# Altium schematic sheet Power.SchDoc
size A3
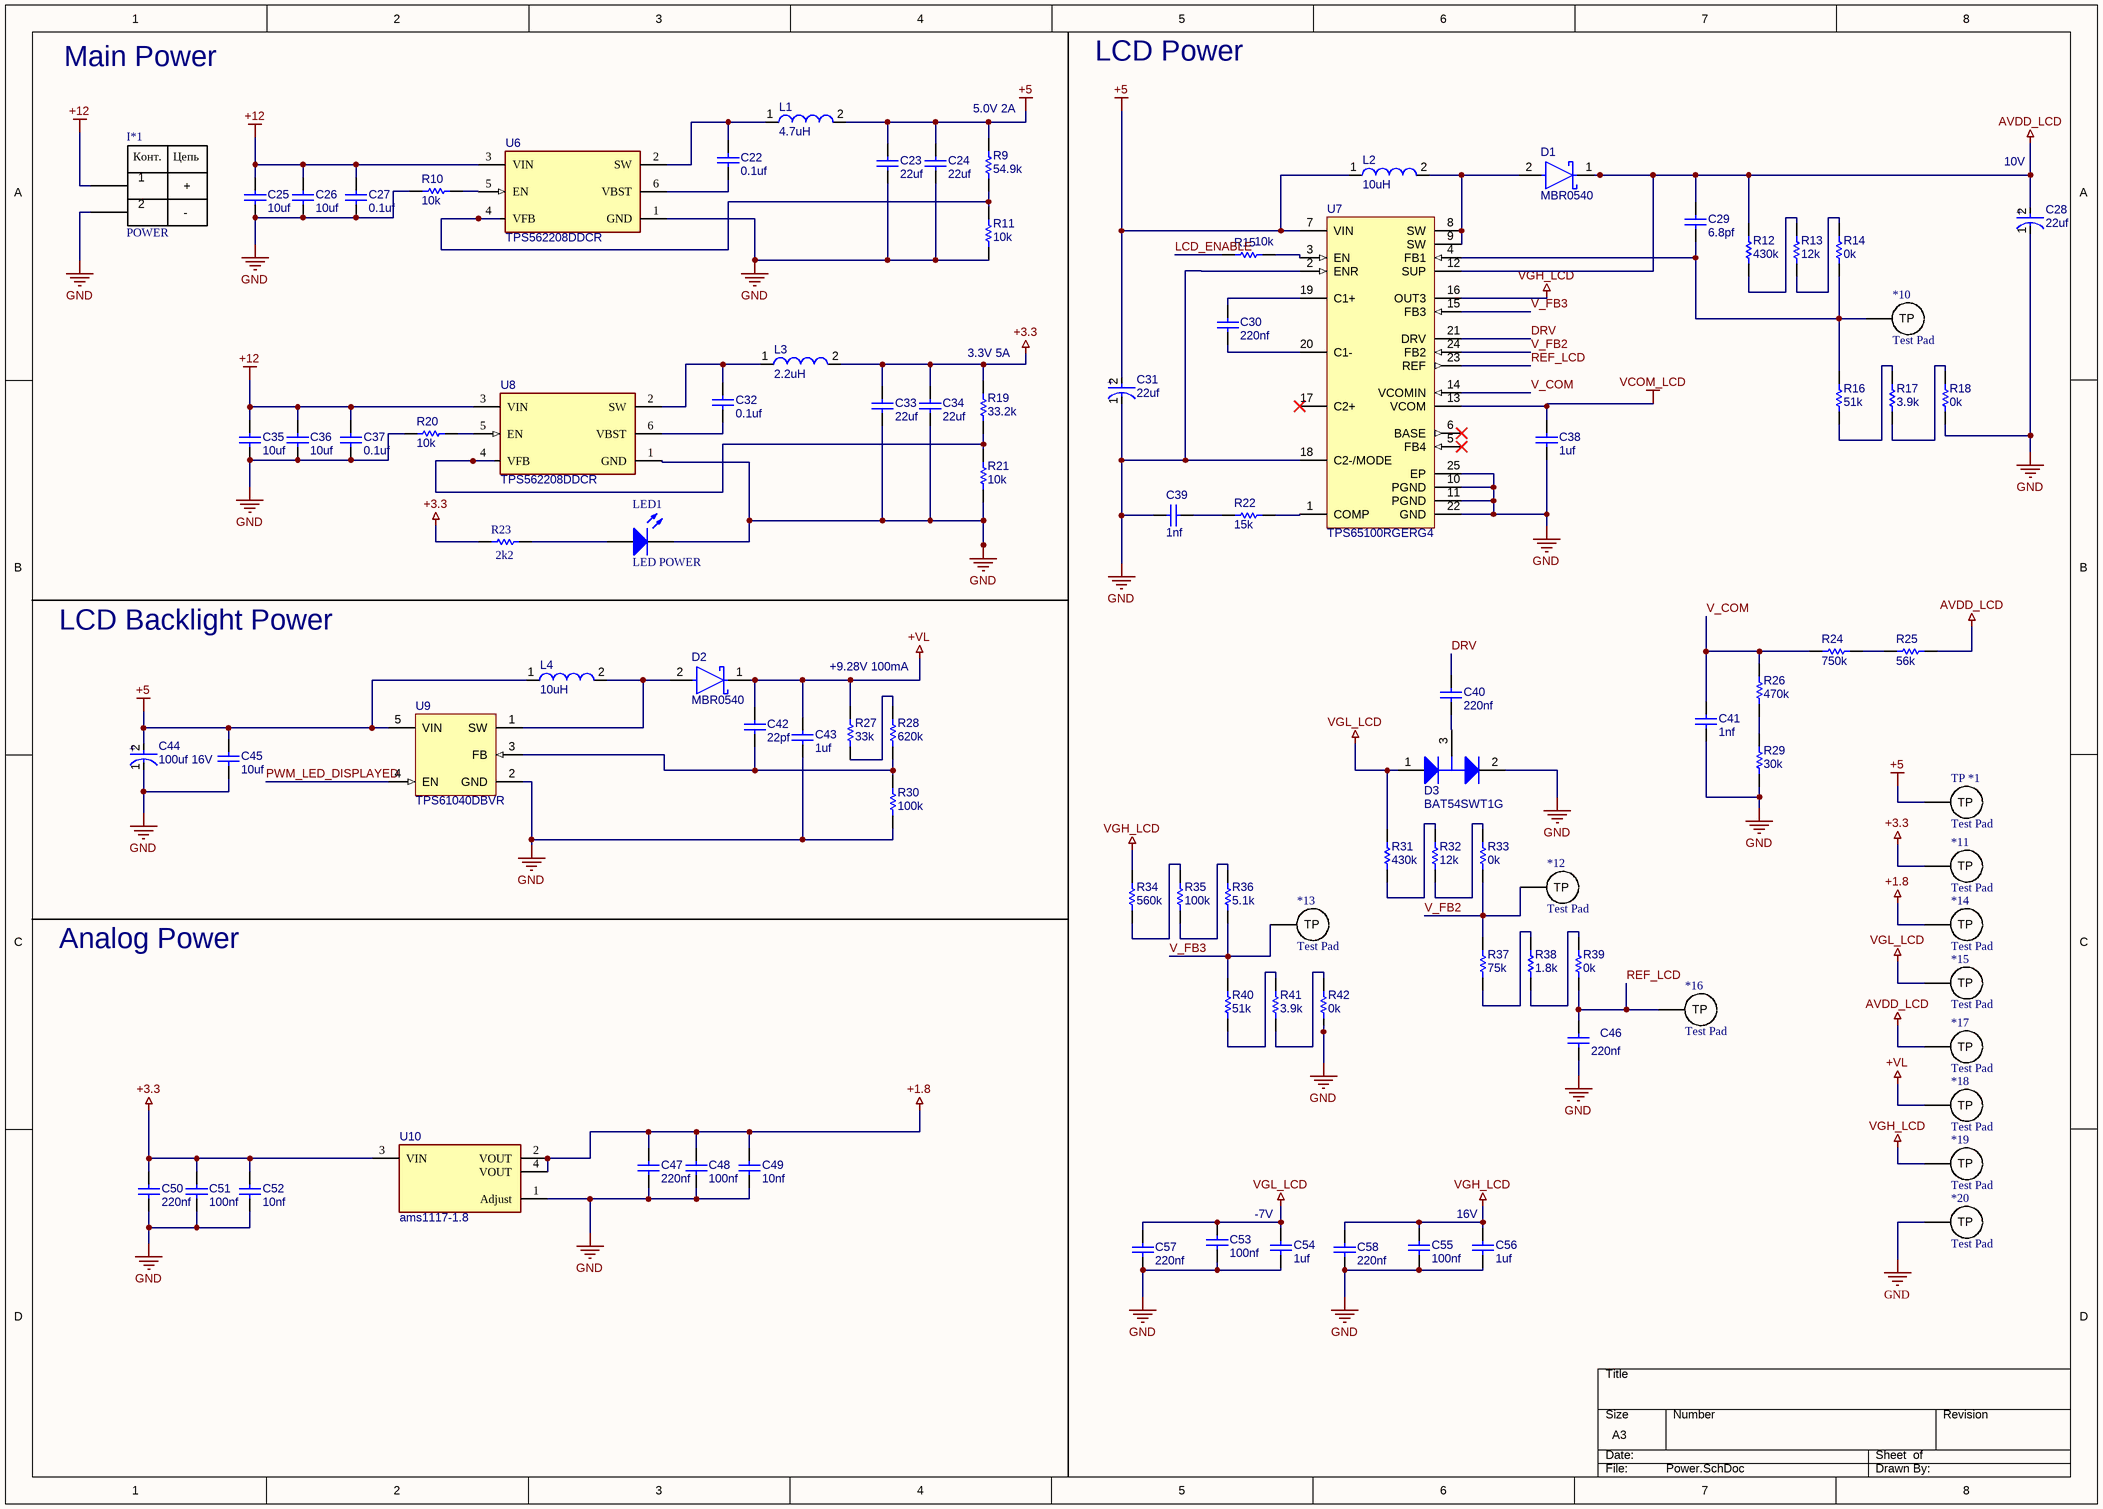
[diagram p0: Power.SchDoc]

## Parts
*10  Test Pad  [Test Pad]
*11  Test Pad  [Test Pad]
*12  Test Pad  [Test Pad]
*13  Test Pad  [Test Pad]
*14  Test Pad  [Test Pad]
*15  Test Pad  [Test Pad]
*16  Test Pad  [Test Pad]
*17  Test Pad  [Test Pad]
*18  Test Pad  [Test Pad]
*19  Test Pad  [Test Pad]
*20  Test Pad  [Test Pad]
C22  0.1uf  [CAPC2013X70X45NL10T25]
C23  22uf  [CAPC2013X70X45NL10T25]
C24  22uf  [CAPC2013X70X45NL10T25]
C25  10uf  [CAPC2013X70X45NL10T25]
C26  10uf  [CAPC2013X70X45NL10T25]
C27  0.1uf  [CAPC2013X70X45NL10T25]
C28  22uf  [FP-TAJD-MFG]
C29  6.8pf  [CAPC2013X70X45NL10T25]
C30  220nf  [CAPC2013X70X45NL10T25]
C31  22uf  [FP-TAJD-MFG]
C32  0.1uf  [CAPC2013X70X45NL10T25]
C33  22uf  [CAPC2013X70X45NL10T25]
C34  22uf  [CAPC2013X70X45NL10T25]
C35  10uf  [CAPC2013X70X45NL10T25]
C36  10uf  [CAPC2013X70X45NL10T25]
C37  0.1uf  [CAPC2013X70X45NL10T25]
C38  1uf  [CAPC2013X70X45NL10T25]
C39  1nf  [CAPC2013X70X45NL10T25]
C40  220nf  [CAPC2013X70X45NL10T25]
C41  1nf  [CAPC2013X70X45NL10T25]
C42  22pf  [CAPC2013X70X45NL10T25]
C43  1uf  [CAPC2013X70X45NL10T25]
C44  100uf 16V  [FP-T491D107K016AT-MFG]
C45  10uf  [CAPC2013X70X45NL10T25]
C46  220nf  [CAPC2013X70X45NL10T25]
C47  220nf  [CAPC2013X70X45NL10T25]
C48  100nf  [CAPC2013X70X45NL10T25]
C49  10nf  [CAPC2013X70X45NL10T25]
C50  220nf  [CAPC2013X70X45NL10T25]
C51  100nf  [CAPC2013X70X45NL10T25]
C52  10nf  [CAPC2013X70X45NL10T25]
C53  100nf  [CAPC2013X70X45NL10T25]
C54  1uf  [CAPC2013X70X45NL10T25]
C55  100nf  [CAPC2013X70X45NL10T25]
C56  1uf  [CAPC2013X70X45NL10T25]
C57  220nf  [CAPC2013X70X45NL10T25]
C58  220nf  [CAPC2013X70X45NL10T25]
D1  MBR0540  [FP-425-04-MFG]
D2  MBR0540  [FP-425-04-MFG]
D3  BAT54SWT1G  [ONSC-SOT-323-3-419-04_V]
I*1  POWER  [POWER]
L1  4.7uH  [WE-TPC-4818-M]
L2  10uH  [WE-PD2-S]
L3  2.2uH  [WE-TPC-4818-M]
L4  10uH  [WE-TPC-4818-M]
LED1  LED POWER  [0805_A]
R9  54.9k  [RESC2013X60X35ML10T20]
R10  10k  [RESC2013X60X35ML10T20]
R11  10k  [RESC2013X60X35ML10T20]
R12  430k  [RESC2013X60X35ML10T20]
R13  12k  [RESC2013X60X35ML10T20]
R14  0k  [RESC2013X60X35ML10T20]
R15  10k  [RESC2013X60X35ML10T20]
R16  51k  [RESC2013X60X35ML10T20]
R17  3.9k  [RESC2013X60X35ML10T20]
R18  0k  [RESC2013X60X35ML10T20]
R19  33.2k  [RESC2013X60X35ML10T20]
R20  10k  [RESC2013X60X35ML10T20]
R21  10k  [RESC2013X60X35ML10T20]
R22  15k  [RESC2013X60X35ML10T20]
R23  2k2  [RESC1608X50X30NL20T20]
R24  750k  [RESC2013X60X35ML10T20]
R25  56k  [RESC2013X60X35ML10T20]
R26  470k  [RESC2013X60X35ML10T20]
R27  33k  [RESC2013X60X35ML10T20]
R28  620k  [RESC2013X60X35ML10T20]
R29  30k  [RESC2013X60X35ML10T20]
R30  100k  [RESC2013X60X35ML10T20]
R31  430k  [RESC2013X60X35ML10T20]
R32  12k  [RESC2013X60X35ML10T20]
R33  0k  [RESC2013X60X35ML10T20]
R34  560k  [RESC2013X60X35ML10T20]
R35  100k  [RESC2013X60X35ML10T20]
R36  5.1k  [RESC2013X60X35ML10T20]
R37  75k  [RESC2013X60X35ML10T20]
R38  1.8k  [RESC2013X60X35ML10T20]
R39  0k  [RESC2013X60X35ML10T20]
R40  51k  [RESC2013X60X35ML10T20]
R41  3.9k  [RESC2013X60X35ML10T20]
R42  0k  [RESC2013X60X35ML10T20]
TP_*1  Test Pad  [Test Pad]
U6  TPS562208DDCR  [FP-DDC0006A-IPC_A]
U7  TPS65100RGERG4  [TI-RGE24-2450X2450TP_V]
U8  TPS562208DDCR  [FP-DDC0006A-IPC_A]
U9  TPS61040DBVR  [DBV0005A_N]
U10  ams1117-1.8  [FP-ams1117-IPC_C]

## Nets
+1.8: *14.1(TP) C47.2 C48.2 C49.2 U10.2(VOUT) U10.4(VOUT)
+3.3: *11.1(TP) C33.2 C34.2 C50.2 C51.2 C52.2 L3.2 R19.2 R23.1 U10.3(VIN)
+5: C23.2 C24.2 C31.2(A) C44.2(A) C45.2 L1.2 L2.1 L4.1 R9.2 TP_*1.1(TP) U7.7(VIN) U9.5(VIN)
+12: C25.2 C26.2 C27.2 C35.2 C36.2 C37.2 I*1.1(+) U6.3(VIN) U8.3(VIN)
+VL: *18.1(TP) C42.2 C43.2 D2.1(C) R27.2
AVDD_LCD: *17.1(TP) C28.2(A) C29.2 D1.1(C) R12.2 R25.1 U7.12(SUP)
GND: *20.1(TP) C23.1 C24.1 C25.1 C26.1 C27.1 C28.1(C) C31.1(C) C33.1 C34.1 C35.1 C36.1 C37.1 C38.1 C39.2 C41.1 C43.1 C44.1(C) C45.1 C46.1 C47.1 C48.1 C49.1 C50.1 C51.1 C52.1 C53.1 C54.1 C55.1 C56.1 C57.1 C58.1 D3.2(K) I*1.2(-) LED1.1(K) R10.1 R11.1 R18.1 R20.1 R21.1 R29.1 R30.1 R42.1 U6.1(GND) U7.2(ENR) U7.10(PGND) U7.11(PGND) U7.18(C2-/MODE) U7.22(GND) U7.25(EP) U8.1(GND) U9.2(GND) U10.1(Adjust)
VCOM_LCD: C38.2 U7.13(VCOM)
VGH_LCD: *19.1(TP) C55.2 C56.2 C58.2 R34.2 U7.16(OUT3)
VGL_LCD: *15.1(TP) C53.2 C54.2 C57.2 D3.1(A) R31.2
DRV: C40.2 U7.21(DRV)
LCD_ENABLE: R15.2
PWM_LED_DISPLAYED: U9.4(EN)
REF_LCD: *16.1(TP) C46.2 R39.1 U7.23(REF)
V_COM: C41.2 R24.2 R26.2 U7.14(VCOMIN)
V_FB2: *12.1(TP) R33.1 R37.2 U7.24(FB2)
V_FB3: *13.1(TP) R36.1 R40.2 U7.15(FB3)
Net*10_1: *10.1(TP) C29.1 R14.1 R16.2 U7.4(FB1)
NetC22_1: C22.1 U6.6(VBST)
NetC22_2: C22.2 L1.1 U6.2(SW)
NetC30_1: C30.1 U7.20(C1-)
NetC30_2: C30.2 U7.19(C1+)
NetC32_1: C32.1 U8.6(VBST)
NetC32_2: C32.2 L3.1 U8.2(SW)
NetC39_1: C39.1 R22.2
NetC40_1: C40.1 D3.3(K/A)
NetC42_1: C42.1 R28.1 R30.2 U9.3(FB)
NetD1_2: D1.2(A) L2.2 U7.8(SW) U7.9(SW)
NetD2_2: D2.2(A) L4.2 U9.1(SW)
NetLED1_2: LED1.2(A) R23.2
NetR9_1: R9.1 R11.2 U6.4(VFB)
NetR10_2: R10.2 U6.5(EN)
NetR12_1: R12.1 R13.2
NetR13_1: R13.1 R14.2
NetR15_1: R15.1 U7.3(EN)
NetR16_1: R16.1 R17.2
NetR17_1: R17.1 R18.2
NetR19_1: R19.1 R21.2 U8.4(VFB)
NetR20_2: R20.2 U8.5(EN)
NetR22_1: R22.1 U7.1(COMP)
NetR24_1: R24.1 R25.2
NetR26_1: R26.1 R29.2
NetR27_1: R27.1 R28.2
NetR31_1: R31.1 R32.2
NetR32_1: R32.1 R33.2
NetR34_1: R34.1 R35.2
NetR35_1: R35.1 R36.2
NetR37_1: R37.1 R38.2
NetR38_1: R38.1 R39.2
NetR40_1: R40.1 R41.2
NetR41_1: R41.1 R42.2

Not connected (* = marked no-connect by the designer): U7 5(FB4)* 6(BASE)* 17(C2+)*

## Notes on the sheet
- Main Power
- 5.0V 2A
- LCD Power
- (near C28) 10V
- (near R19) 3.3V 5A
- LCD Backlight Power
- +9.28V 100mA
- Analog Power
- (near C54) -7V
- (near C56) 16V
- (in symbol CMP-2000-07541-2) +
- (in symbol CMP-04424-000507-1) +
- (in symbol POWER) Конт.; Цепь

## Library data of the parts
C22-C27 C29 C30 C32-C43 C45-C58 = CMP-2007-00957-1: Part Number: GRM216R61E105KA12D; Manufacturer: Murata
C28 C31 = CMP-04424-000507-1: 22uF 16V  ±20% 1.1Ω 2917  SMD Tantalum Capacitor; Dissipation Factor: 6%; Q Factor: 6; ESR (Equivalent Series Resistance): 1.1R; Polarity: Polar; Leakage Current: 3.5uA; Height: 3.1mm; RoHS Compliant: Yes; Series: TAJ; Min Operating Temperature: -55°C; Case/Package: 2917; Construction: Flat; Length: 7.3mm; Radiation Hardening: No; Features: General Purpose; Number of Pins: 2; Height - Seated (Max): 0.122inch; Lead Free: Lead Free; Mount: Surface Mount; REACH SVHC: No SVHC; Packaging: Tape and Reel; Voltage Rating (DC): 16V; Capacitance: 22uF; Width: 4.3mm; Voltage Rating: 16V; Case Code (Imperial): 2917; Package Quantity: 1; Tolerance: 20%; Case Code (Metric): 7343; Depth: 4.3mm; Termination: SMD/SMT; Max Operating Temperature: 125°C
C44 = CMP-2000-07541-2: CAP TANT 100UF 10% 16V 2917; Life (Hours): 2000Hour; ESR (Equivalent Series Resistance): 700mR; Polarity: Polar; Ripple Current: 463mA; Dielectric Material: Tantalum; Leakage Current: 16uA; Dissipation Factor: 8%; Case Code (Imperial): 2917; Width: 4.3mm; Lead Pitch: 3.6mm; Max Operating Temperature: 125°C; Capacitance: 100uF; Packaging: Tape and Reel; Depth: 4.3mm; Voltage Rating: 16V; Height - Seated (Max): 0.122inch; Tolerance: 10%; Voltage: 16V; Voltage Rating (DC): 16V; Length: 7.3mm; Case Code (Metric): 7343; Package Quantity: 1; RoHS Compliant: Yes; Height: 2.8mm; Weight: 0.023634oz; Radiation Hardening: No; REACH SVHC: No SVHC; Features: General Purpose; Termination: SMD/SMT; Min Operating Temperature: -55°C; Mount: Surface Mount; Lead Free: Lead Free; Case/Package: Molded
D1 D2 = CMP-2000-05114-2: DIODE SCHOTTKY 40V 500MA SOD123; Max Surge Current: 5.5A; Max Reverse Leakage Current: 20uA; Forward Voltage: 620mV; Element Configuration: Single; Polarity: Standard; Power Dissipation: 400mW; Current Rating: 500A; Max Operating Temperature: 125°C; REACH SVHC: No SVHC; Voltage Rating (DC): 40V; Mount: Surface Mount; Max Reverse Voltage (DC): 40V; Max Forward Surge Current (Ifsm): 5.5A; Height: 1.03mm; Package Quantity: 3000; Forward Current: 500mA; Average Rectified Current: 500mA; Weight: 0.03g; Output Current: 500mA; Contact Plating: Tin; Packaging: Tape and Reel; Width: 1.6mm; Radiation Hardening: No; Peak Non-Repetitive Surge Current: 5.5A; Max Repetitive Reverse Voltage (Vrrm): 40V; Length: 2.7mm; Lead Free: Lead Free; Min Operating Temperature: -65°C; Number of Pins: 2; Peak Reverse Current: 20uA
D3 = CMP-1055-00559-1: Dual Series Schottky Barrier Diodes, 3-Pin SOT-323, Pb-Free, Tape and Reel; Manufacturer: On Semiconductor; trr Max (ns): 5; IFSM Max (A): 0.6; ComponentLink1URL: http://www.onsemi.com/; Mounting Technology: Surface Mount; ComponentLink1Description: Manufacturer URL; ComponentLink3URL: http://www.onsemi.com/pub_link/Collateral/419-04.PDF; RoHS: TRUE; PackageVersion: Rev. N, 11/2008; Packing: Tape and Reel; PackageReference: SOT-323-3-419-04; ComponentLink2URL: http://www.onsemi.cn/pub_link/Collateral/BAT54SWT1-D.PDF; ComponentLink3Description: Package Specification; PackageDescription: 3-Pin Small Outline Transistor, Body 2 x 1.25 mm, Pitch 0.65 mm; ComponentLink2Description: Datasheet; PartNumber: BAT54SWT1G; DatasheetVersion: Rev. 10; Configuration: Dual
L1 L3 L4 = CMP-0227-00369-1: SMD Shielded Tiny Power Inductor WE-TPC, L = 3.90 µH; Inductance: 3.90 ÂµH; ComponentLink1Description: Manufacturer Link; PackageReference: WE-TPC-4818-M; PackageDescription: SMD Inductor, 2-Leads, Body 4.8 x 4.8 mm; ComponentLink2URL: http://www.we-online.de/katalog/media/pdf/7440420039.pdf; DatasheetVersion: ver 6, Aug-2010; ComponentLink2Description: Datasheet; ComponentLink1URL: http://www.we-online.com; PackageVersion: 2010
L2 = CMP-0227-00477-1: SMD Power Inductor WE-PD2, L = 10.0 µH; Inductance: 10.0 ÂµH; ComponentLink2Description: Datasheet; ComponentLink1Description: Manufacturer Link; ComponentLink1URL: http://www.we-online.com; ComponentLink2URL: http://www.we-online.de/katalog/media/pdf/74477310.pdf; PackageDescription: SMD Inductor, 2-Leads, Body 4.5 x 4.0 mm; DatasheetVersion: ver 1, Oct-2004; PackageReference: WE-PD2-S; PackageVersion: 2004
LED1 = CMP-1426-00011-1: SMD mono-color Chip LED, WL-SMCW, Red; PartNumber: 150080RS75000; Manufacturer: Wuerth Elektronik; Color: Red; PackageReference: 0805_A; ComponentLink2Description: Datasheet; ComponentLink1URL: http://www.we-online.com; ComponentLink1Description: Manufacturer URL; ComponentLink2URL: http://katalog.we-online.com/led/datasheet/150080RS75000.pdf
R9-R22 R24-R42 = CMP-2100-03671-1: Chip Resistor, 1 KOhm, +/- 1%, 125 mW, -55 to 155 degC, 0805 (2012 Metric), RoHS, Tape and Reel; Manufacturer: Yageo; Temperature Coefficient: 100ppm/degreesC; Voltage Rating (DC): 150V; Max Power Dissipation: 125mW; Resistance: 1KOhm; Number of Pins: 2; Number of Terminations: 2; Datasheet URL: http://www.yageo.com/NewPortal/yageodocoutput?fileName=/pdf/R-Chip/PYu-RC_Group_51_RoHS_L_5.pdf; Length: 0.079inch; Package Description: 2-Pin Surface Mounted Device, Body 2 x 1.25 mm; Depth: 1.25mm; Height: 0.024inch; Military Standard: Not; Case/Package: 0805; Package Reference: 0805; RoHSCompliant: true; Lead Free: LeadFree; Packaging: TapeandReel; Package Quantity: 1; Datasheet Version: Rev. 5, 10/2016; Tolerance: 1%; Min Operating Temperature: -55degC; Voltage Rating: 150V; Composition: ThickFilm; Case Code (Imperial): 0805; Power Rating: 125mW; Width: 0.049inch; Case Code (Metric): 2012; Manufacturer URL: http://www.yageo.com/; Max Operating Temperature: 155degC; REACH SVHC: Unknown; Termination: SMD/SMT
R23 = CMP-2000-02744-1: Part Number: RR0816P-753-B-T5; Manufacturer: Susumu
U6 U8 = CMP-04918-000412-1: IC REG BUCK ADJ 2A TSOT23-6; Output Configuration: Positive; Max Input Voltage: 17V; Synchronous Rectifier: Yes; Number of Outputs: 1; Switching Frequency: 580kHz; Min Input Voltage: 4.5V; Max Output Voltage: 7V; Quiescent Current: 400uA; Min Output Voltage: 768mV; Output Type: Adjustable; Packaging: Tape and Reel; Case/Package: SOT-23-6; Lead Free: Lead Free; Mount: Surface Mount; Max Operating Temperature: 125°C; RoHS Compliant: Yes; Output Current: 2A; Min Operating Temperature: -40°C
U7 = CMP-0388-00558-1: 4-Channel LCD Bias with Fully Integrated Postive Charge Pump, 3.3 V LDO Controller, 2.7 to 5.8 V, -40 to 85 degC, 24-pin QFN (RGE24), Green (RoHS & no Sb/Br); Manufacturer: Texas Instruments; Rating: Catalog; Vin(Max)(V): 5.8; Iq(Typ)(mA): 0.7; Iout(Max)(A): 0.02; Switching Frequency(Typ)(kHz): 1600; Vin(Min)(V): 2.7; SubFamily: LCD/OLED Display Bias Solutions; Topology: Boost, Inverting Buck/Boost; ComponentLink2Description: Datasheet; PartNumber: TPS65100RGERG4; Code_JEDEC: MO-220; PackageVersion: 4204104/G; ComponentLink3URL: http://www.ti.com/litv/pdf/mpqf124f; ComponentLink2URL: http://www.ti.com/general/docs/lit/getliterature.tsp?genericPartNumber=TPS65100&fileType=pdf; Mounting Technology: Surface Mount; DatasheetVersion: SLVS496C; ComponentLink1Description: Manufacturer URL; ComponentLink1URL: http://www.ti.com/; PackageDescription: 24-Pin Plastic Flat Pack, Body 4 x 4 mm, 0.5 mm Pitch; PackageReference: RGE24-2450X2450TP; Eco-Plan: Green (RoHS & no Sb/Br); ComponentLink3Description: Package Specification
U9 = CMP-0388-00113-2: 28 V, 400 mA Switch Boost Converter for White LED Applications, 1.8 to 6 V, -40 to 85 degC, 5-pin SOT23 (DBV5), Green (RoHS & no Sb/Br); Manufacturer: Texas Instruments; Switching Frequency(Max)(kHz): 1000; Rating: Catalog; Dimming: TRUE; Iq(Typ)(mA): 0.028; Iout(Max)(A): 0.09; SubFamily: White LED Driver; Vin(Min)(V): 1.8; Vin(Max)(V): 6; PackageDescription: 5-Pin Plastic Small Outline, Body 1.60 Ãƒâ€” 2.90 mm, Pitch 0.95 mm; Eco-Plan: Green (RoHS & no Sb/Br); ComponentLink1Description: Manufacturer URL; ComponentLink1URL: http://www.ti.com/; PackageVersion: 4073253-4/K; ComponentLink2Description: Datasheet; ComponentLink2URL: http://www.ti.com/general/docs/lit/getliterature.tsp?genericPartNumber=TPS61040&fileType=pdf; Code_JEDEC: MO-178; DatasheetVersion: SLVS413F; Mounting Technology: Surface Mount; PackageReference: DBV0005A; PartNumber: TPS61040DBVR; Topology: Boost; ComponentLink3Description: Package Specification; ComponentLink3URL: http://www.ti.com/litv/pdf/mpds018i
U10 = CMP-209535-000002-1: 1A LOW DROPOUT VOLTAGE REGULATOR; RoHS Compliant: Yes